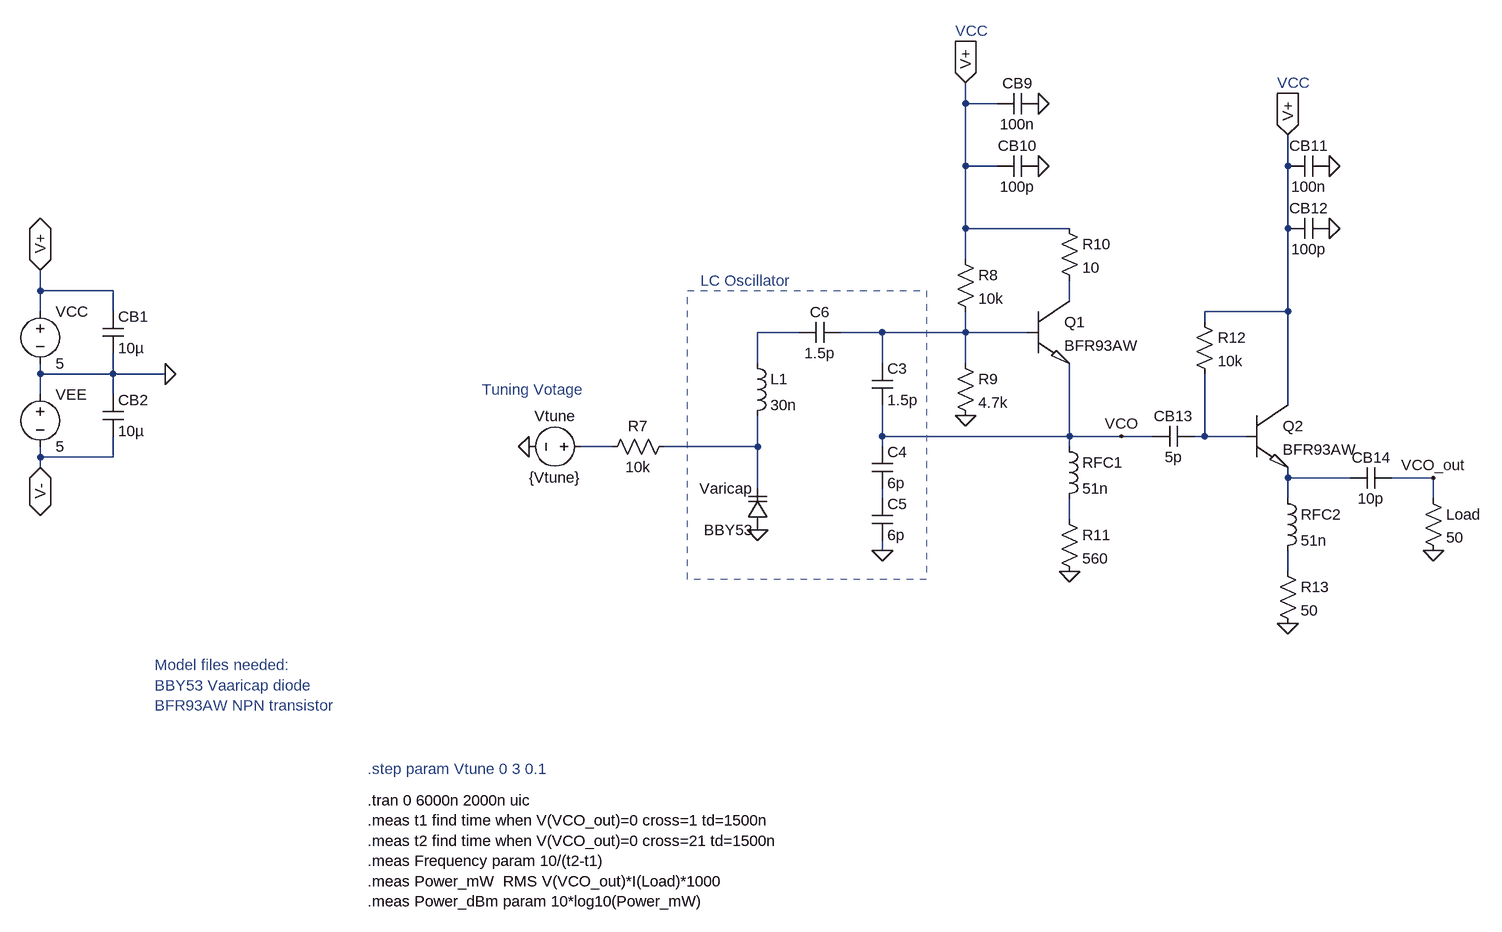
[diagram p0: schematic VCO.asc]
VCO.asc, the LTspice schematic file:
Version 4
SHEET 1 4684 1168
WIRE 1360 -112 1360 -144
WIRE 1408 -112 1360 -112
WIRE 1360 -16 1360 -112
WIRE 1408 -16 1360 -16
WIRE 1856 -16 1856 -64
WIRE 1360 80 1360 -16
WIRE 1520 80 1360 80
WIRE 1856 80 1856 -16
WIRE 1360 128 1360 80
WIRE -64 176 -64 144
WIRE 48 176 -64 176
WIRE 1520 192 1520 160
WIRE -64 208 -64 176
WIRE 48 208 48 176
WIRE 1856 208 1856 80
WIRE 1856 208 1728 208
WIRE 1728 224 1728 208
WIRE 1104 240 1040 240
WIRE 1232 240 1168 240
WIRE 1360 240 1360 208
WIRE 1360 240 1232 240
WIRE 1456 240 1360 240
WIRE 1040 288 1040 240
WIRE 1232 288 1232 240
WIRE 1360 288 1360 240
WIRE -64 304 -64 288
WIRE 48 304 48 272
WIRE 48 304 -64 304
WIRE 128 304 48 304
WIRE -64 336 -64 304
WIRE 48 336 48 304
WIRE 1856 352 1856 208
WIRE 1232 400 1232 352
WIRE 1520 400 1520 288
WIRE 1520 400 1232 400
WIRE 1600 400 1520 400
WIRE 1648 400 1600 400
WIRE 1728 400 1728 304
WIRE 1728 400 1712 400
WIRE 1792 400 1728 400
WIRE 816 416 768 416
WIRE 1040 416 1040 368
WIRE 1040 416 896 416
WIRE 1232 416 1232 400
WIRE 1520 416 1520 400
WIRE -64 432 -64 416
WIRE 48 432 48 400
WIRE 48 432 -64 432
WIRE -64 448 -64 432
WIRE 1856 464 1856 448
WIRE 1952 464 1856 464
WIRE 2080 464 2016 464
WIRE 1040 480 1040 416
WIRE 1232 496 1232 480
WIRE 1856 496 1856 464
WIRE 2080 496 2080 464
WIRE 1520 528 1520 496
WIRE 1232 576 1232 560
WIRE 1856 608 1856 576
FLAG 128 304 0
FLAG -64 144 V+
IOPIN -64 144 BiDir
FLAG -64 448 V-
IOPIN -64 448 BiDir
FLAG 1472 -16 0
FLAG 1520 608 0
FLAG 688 416 0
FLAG 1040 544 0
FLAG 1360 368 0
FLAG 1472 -112 0
FLAG 1920 80 0
FLAG 1920 -16 0
FLAG 1600 400 VCO
FLAG 1856 688 0
FLAG 1232 576 0
FLAG 2080 576 0
FLAG 1360 -144 V+
IOPIN 1360 -144 In
FLAG 1856 -64 V+
IOPIN 1856 -64 In
FLAG 2080 464 VCO_out
SYMBOL voltage -64 192 R0
SYMATTR InstName VCC
SYMATTR Value 5
SYMBOL voltage -64 320 R0
SYMATTR InstName VEE
SYMATTR Value 5
SYMBOL Cap 32 208 R0
SYMATTR InstName CB1
SYMATTR Value 10µ
SYMBOL Cap 32 336 R0
SYMATTR InstName CB2
SYMATTR Value 10µ
SYMBOL Cap 1472 -32 R90
WINDOW 0 0 32 VBottom 2
WINDOW 3 32 32 VTop 2
SYMATTR InstName CB10
SYMATTR Value 100p
SYMBOL Res 1344 112 R0
SYMATTR InstName R8
SYMATTR Value 10k
SYMBOL Res 1504 512 R0
SYMATTR InstName R11
SYMATTR Value 560
SYMBOL Cap 1216 288 R0
SYMATTR InstName C3
SYMATTR Value 1.5p
SYMBOL Cap 1216 416 R0
SYMATTR InstName C4
SYMATTR Value 6p
SYMBOL Ind 1024 272 R0
SYMATTR InstName L1
SYMATTR Value 30n
SYMBOL Voltage 784 416 R90
WINDOW 0 -32 56 VBottom 2
WINDOW 3 32 56 VTop 2
SYMATTR InstName Vtune
SYMATTR Value {Vtune}
SYMBOL Res 1344 272 R0
SYMATTR InstName R9
SYMATTR Value 4.7k
SYMBOL Cap 1168 224 R90
WINDOW 0 0 32 VBottom 2
WINDOW 3 32 32 VTop 2
SYMATTR InstName C6
SYMATTR Value 1.5p
SYMBOL Ind 1504 400 R0
SYMATTR InstName RFC1
SYMATTR Value 51n
SYMBOL varactor 1056 544 R180
WINDOW 0 24 64 Left 2
WINDOW 3 24 0 Left 2
SYMATTR InstName Varicap
SYMATTR Value BBY53
SYMBOL Res 912 400 R90
WINDOW 0 0 56 VBottom 2
WINDOW 3 32 56 VTop 2
SYMATTR InstName R7
SYMATTR Value 10k
SYMBOL Res 1712 208 R0
SYMATTR InstName R12
SYMATTR Value 10k
SYMBOL Cap 1472 -128 R90
WINDOW 0 0 32 VBottom 2
WINDOW 3 32 32 VTop 2
SYMATTR InstName CB9
SYMATTR Value 100n
SYMBOL Res 1504 64 R0
SYMATTR InstName R10
SYMATTR Value 10
SYMBOL Cap 1712 384 R90
WINDOW 0 0 32 VBottom 2
WINDOW 3 32 32 VTop 2
SYMATTR InstName CB13
SYMATTR Value 5p
SYMBOL Cap 1920 64 R90
WINDOW 0 0 32 VBottom 2
WINDOW 3 32 32 VTop 2
SYMATTR InstName CB12
SYMATTR Value 100p
SYMBOL Cap 1920 -32 R90
WINDOW 0 0 32 VBottom 2
WINDOW 3 32 32 VTop 2
SYMATTR InstName CB11
SYMATTR Value 100n
SYMBOL Ind 1840 480 R0
SYMATTR InstName RFC2
SYMATTR Value 51n
SYMBOL Cap 2016 448 R90
WINDOW 0 0 32 VBottom 2
WINDOW 3 32 32 VTop 2
SYMATTR InstName CB14
SYMATTR Value 10p
SYMBOL BFR93AW/BFR93AW 1456 192 R0
SYMATTR InstName Q1
SYMBOL BFR93AW/BFR93AW 1792 352 R0
SYMATTR InstName Q2
SYMBOL Res 1840 592 R0
SYMATTR InstName R13
SYMATTR Value 50
SYMBOL Cap 1216 496 R0
SYMATTR InstName C5
SYMATTR Value 6p
SYMBOL Res 2064 480 R0
SYMATTR InstName Load
SYMATTR Value 50
TEXT 616 328 Left 2 ;Tuning Votage
TEXT 440 960 Left 2 !.tran 0 6000n 2000n uic\n.meas t1 find time when V(VCO_out)=0 cross=1 td=1500n\n.meas t2 find time when V(VCO_out)=0 cross=21 td=1500n\n.meas Frequency param 10/(t2-t1)\n.meas Power_mW  RMS V(VCO_out)*I(Load)*1000\n.meas Power_dBm param 10*log10(Power_mW)
TEXT 440 912 Left 2 ;.step param Vtune 0 3 0.1
TEXT 112 752 Left 2 ;Model files needed:\nBBY53 Vaaricap diode\nBFR93AW NPN transistor
TEXT 952 160 Left 2 ;LC Oscillator
TEXT 1344 -224 Left 2 ;VCC
TEXT 1840 -144 Left 2 ;VCC
RECTANGLE Normal 932 176 1300 620 2

The netlist it stands for:
* VCO.asc
VCC V+ 0 5
VEE 0 V- 5
CB1 V+ 0 10µ
CB2 0 V- 10µ
CB10 0 V+ 100p
R8 V+ N003 10k
R11 N009 0 560
C3 N003 VCO 1.5p
C4 VCO N008 6p
L1 N002 N006 30n
Vtune N005 0 {Vtune}
R9 N003 0 4.7k
C6 N003 N002 1.5p
L§RFC1 VCO N009 51n
D§Varicap 0 N006 BBY53
R7 N006 N005 10k
R12 V+ N004 10k
CB9 0 V+ 100n
R10 V+ N001 10
CB13 N004 VCO 5p
CB12 0 V+ 100p
CB11 0 V+ 100n
L§RFC2 N007 N010 51n
CB14 VCO_out N007 10p
XQ1 N001 N003 VCO BFR93AW  ; pins C B E
XQ2 V+ N004 N007 BFR93AW  ; pins C B E
R13 N010 0 50
C5 N008 0 6p
R§Load VCO_out 0 50
.model D D
.lib standard.dio
* Tuning Votage
.tran 0 6000n 2000n uic
.meas t1 find time when V(VCO_out)=0 cross=1 td=1500n
.meas t2 find time when V(VCO_out)=0 cross=21 td=1500n
.meas Frequency param 10/(t2-t1)
.meas Power_mW  RMS V(VCO_out)*I(Load)*1000
.meas Power_dBm param 10*log10(Power_mW)
* .step param Vtune 0 3 0.1
* Model files needed:
* BBY53 Vaaricap diode
* BFR93AW NPN transistor
* LC Oscillator
* VCC
* VCC
.lib BFR93AW.lib
.backanno
.end